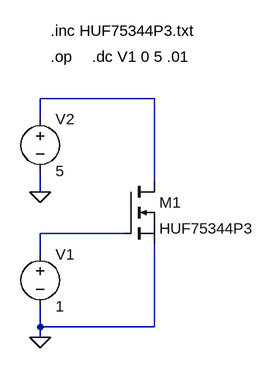
[diagram p0: schematic HUF75344P3_test.asc]
HUF75344P3_test.asc, the LTspice schematic file:
Version 4
SHEET 1 1392 2576
WIRE -48 80 -224 80
WIRE -224 112 -224 80
WIRE -48 208 -48 80
WIRE -224 224 -224 192
WIRE -96 288 -224 288
WIRE -224 320 -224 288
WIRE -224 432 -224 400
WIRE -48 432 -48 304
WIRE -48 432 -224 432
WIRE -224 448 -224 432
FLAG -224 448 0
FLAG -224 224 0
SYMBOL nmos -96 208 R0
SYMATTR InstName M1
SYMATTR Value HUF75344P3
SYMATTR Prefix X
SYMBOL voltage -224 304 R0
SYMATTR InstName V1
SYMATTR Value 1
SYMBOL voltage -224 96 R0
SYMATTR InstName V2
SYMATTR Value 5
TEXT -208 16 Left 0 !.op
TEXT -144 16 Left 0 !.dc V1 0 5 .01
TEXT -208 -24 Left 0 !.inc HUF75344P3.txt

The netlist it stands for:
* HUF75344P3_test.asc
XM1 N001 N002 0 HUF75344P3  ; pins D G S
V1 N002 0 1
V2 N001 0 5
.op
.dc V1 0 5 .01
.inc HUF75344P3.txt
.backanno
.end